# EAGLE design HS(LCD)_1 (EAGLE 8.3.0)
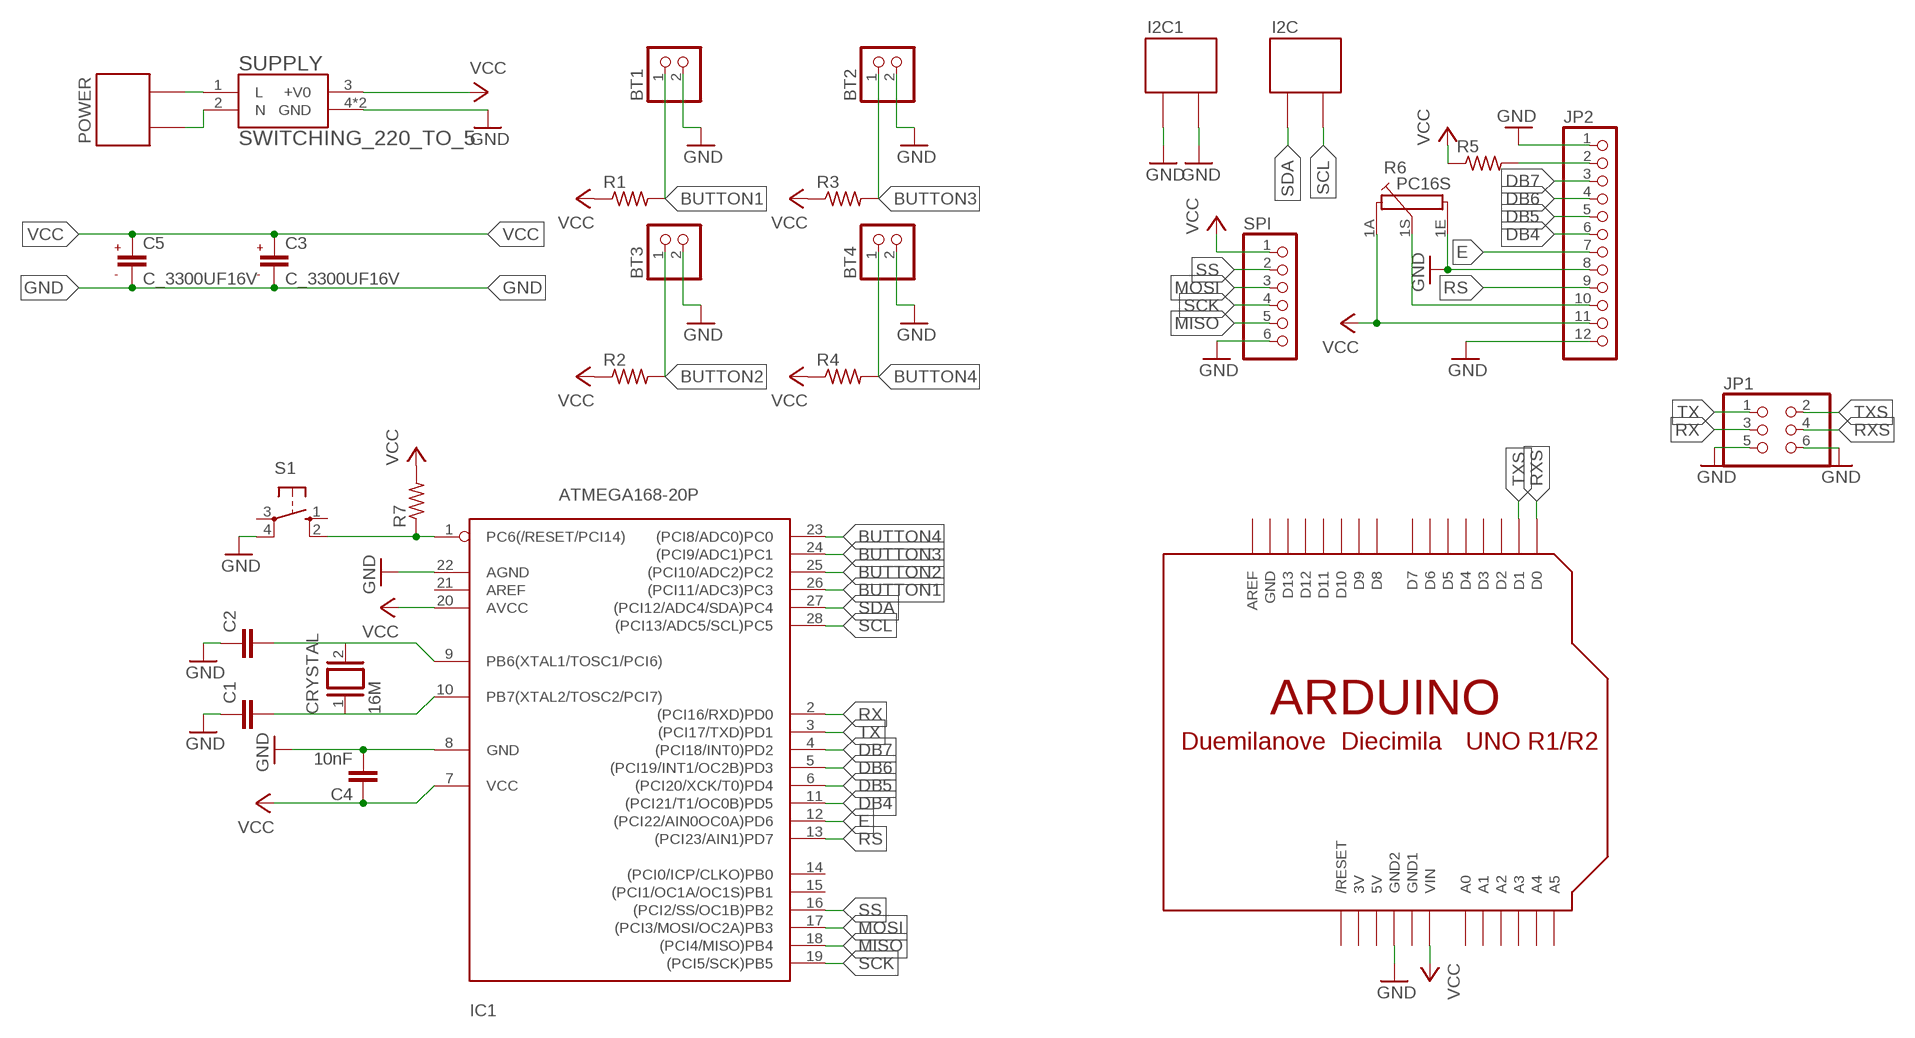
[diagram p0: schematic, sheet 1]

## Parts
BT1  PINHD-1X2  [1X02]
BT2  PINHD-1X2  [1X02]
BT3  PINHD-1X2  [1X02]
BT4  PINHD-1X2  [1X02]
C1  C-EU025-024X044  [C025-024X044]
C2  C-EU025-024X044  [C025-024X044]
C3  C_3300UF16V  [RADIAL_3300UF16V]
C4  10nF  C5/2.5  [C5B2.5]
C5  C_3300UF16V  [RADIAL_3300UF16V]
CRYSTAL  16M  XTAL/S  [QS]
I2C  2PIN_TERMINAL_BLOCK  [2PIN_TERMINAL_BLOCK]
I2C1  2PIN_TERMINAL_BLOCK  [2PIN_TERMINAL_BLOCK]
IC1  ATMEGA168-20P  [DIL28-3]
JP1  PINHD-2X3  [2X03]
JP2  PINHD-1X12  [1X12]
POWER  2PIN_TERMINAL_BLOCK  [2PIN_TERMINAL_BLOCK]
R1  R-US_0204/7  [0204/7]
R2  R-US_0204/7  [0204/7]
R3  R-US_0204/7  [0204/7]
R4  R-US_0204/7  [0204/7]
R5  R-US_0204/7  [0204/7]
R6  PC16S  [PC16S]
R7  R-US_0204/7  [0204/7]
S1  10-XX  [B3F-10XX]
SPI  PINHD-1X6  [1X06]
SUPPLY  SWITCHING_220_TO_5  [SUPPLY_220V_5V]
U$1  ARDUINO-NOHOLE  [ARDUINO-NOHOLE]

## Nets
BUTTON1: BT1.1 IC1.26((PCI11/ADC3)PC3) R1.2
BUTTON2: BT3.1 IC1.25((PCI10/ADC2)PC2) R2.2
BUTTON3: BT2.1 IC1.24((PCI9/ADC1)PC1) R3.2
BUTTON4: BT4.1 IC1.23((PCI8/ADC0)PC0) R4.2
DB4: IC1.11((PCI21/T1/OC0B)PD5) JP2.6
DB5: IC1.6((PCI20/XCK/T0)PD4) JP2.5
DB6: IC1.5((PCI19/INT1/OC2B)PD3) JP2.4
DB7: IC1.4((PCI18/INT0)PD2) JP2.3
E: IC1.12((PCI22/AIN0OC0A)PD6) JP2.7
GND: BT1.2 BT2.2 BT3.2 BT4.2 C1.1 C2.1 C3.1(GND) C4.2 C5.1(GND) I2C1.P$1 I2C1.P$2 IC1.8(GND) IC1.22(AGND) JP1.5 JP1.6 JP2.1 JP2.8 JP2.12 R6.1E S1.4(P1) SPI.6 SUPPLY.4(GND) SUPPLY.5(GND) U$1.GND2
LEDP: JP2.2 R5.2
MISO: IC1.18((PCI4/MISO)PB4) SPI.5
MOSI: IC1.17((PCI3/MOSI/OC2A)PB3) SPI.3
N$1: C2.2 CRYSTAL.2 IC1.9(PB6(XTAL1/TOSC1/PCI6))
N$2: C1.2 CRYSTAL.1 IC1.10(PB7(XTAL2/TOSC2/PCI7))
N$3: POWER.P$2 SUPPLY.1(L)
N$4: POWER.P$1 SUPPLY.2(N)
N$5: IC1.1(PC6(/RESET/PCI14)) R7.1 S1.2(S1)
RS: IC1.13((PCI23/AIN1)PD7) JP2.9
RX: IC1.2((PCI16/RXD)PD0) JP1.3
RXS: JP1.4 U$1.D0
SCK: IC1.19((PCI5/SCK)PB5) SPI.4
SCL: I2C.P$2 IC1.28((PCI13/ADC5/SCL)PC5)
SDA: I2C.P$1 IC1.27((PCI12/ADC4/SDA)PC4)
SS: IC1.16((PCI2/SS/OC1B)PB2) SPI.2
TX: IC1.3((PCI17/TXD)PD1) JP1.1
TXS: JP1.2 U$1.D1
V0: JP2.10 R6.1S
VCC: C3.2(VCC) C4.1 C5.2(VCC) IC1.7(VCC) IC1.20(AVCC) JP2.11 R1.1 R2.1 R3.1 R4.1 R5.1 R6.1A R7.2 SPI.1 SUPPLY.3(+V0) U$1.VIN
Unconnected: IC1.14((PCI0/ICP/CLKO)PB0) IC1.15((PCI1/OC1A/OC1S)PB1) IC1.21(AREF) S1.1(S) S1.3(P) U$1.A0 U$1.A1 U$1.A2 U$1.A3 U$1.A4 U$1.A5 U$1.AREF U$1.D2 U$1.D3 U$1.D4 U$1.D5 U$1.D6 U$1.D7 U$1.D8 U$1.D9 U$1.D10 U$1.D11 U$1.D12 U$1.D13 U$1.RESET(/RESET)

## Power pins joined to a net without a drawn wire
3V: U$1.3V
5V: U$1.5V
GND: U$1.GND
GND1: U$1.GND1

## Library data of the parts
BT1-BT4 = pinhead:PINHD-1X2: PIN HEADER
C1 C2 = resistor:C-EU: CAPACITOR, European symbol
C3 C5 = tu_capacitor:C_3300UF16V
C4 = capacitor-wima:C: CAPACITOR naming: grid - package width
CRYSTAL = special:XTAL/S: CRYSTAL
I2C I2C1 POWER = 2pin_terminal_block:2PIN_TERMINAL_BLOCK
IC1 = adafruit:ATMEGA168*P: MICROCONTROLLER 16 kBytes FLASH 1 kBytes SRAM 512 Bytes EEPROM USART 8-channel 10 bit ADC
JP1 = pinhead:PINHD-2X3: PIN HEADER
JP2 = pinhead:PINHD-1X12: PIN HEADER
R1-R4 R7 = adafruit:R-US_: RESISTOR, American symbol
R5 = rcl:R-US_: RESISTOR, American symbol
R6 = piher:PC16S: POTENTIOMETER single carbon potentiometer, 16 mm, S3ROH; OC_FARNELL: 4452940; OC_NEWARK: unknown
S1 = switch-omron:10-XX: OMRON SWITCH; MPN: B3F-1000; OC_FARNELL: 176432; OC_NEWARK: 36M3542
SPI = pinhead:PINHD-1X6: PIN HEADER
SUPPLY = switching_supply:SWITCHING_220_TO_5
U$1 = adafruit:ARDUINO: Arduino Diecimila/Duemilanove Make a shield with ease, this package has all the named pins as well as the two mounting drill holes and an outline of the USB and DC power connector. The outline is on the DIMENSION layer, so if your board house uses it they will cut the outline to match. http://www.ladyada.net/library/pcb/eaglelibrary.html

## Board
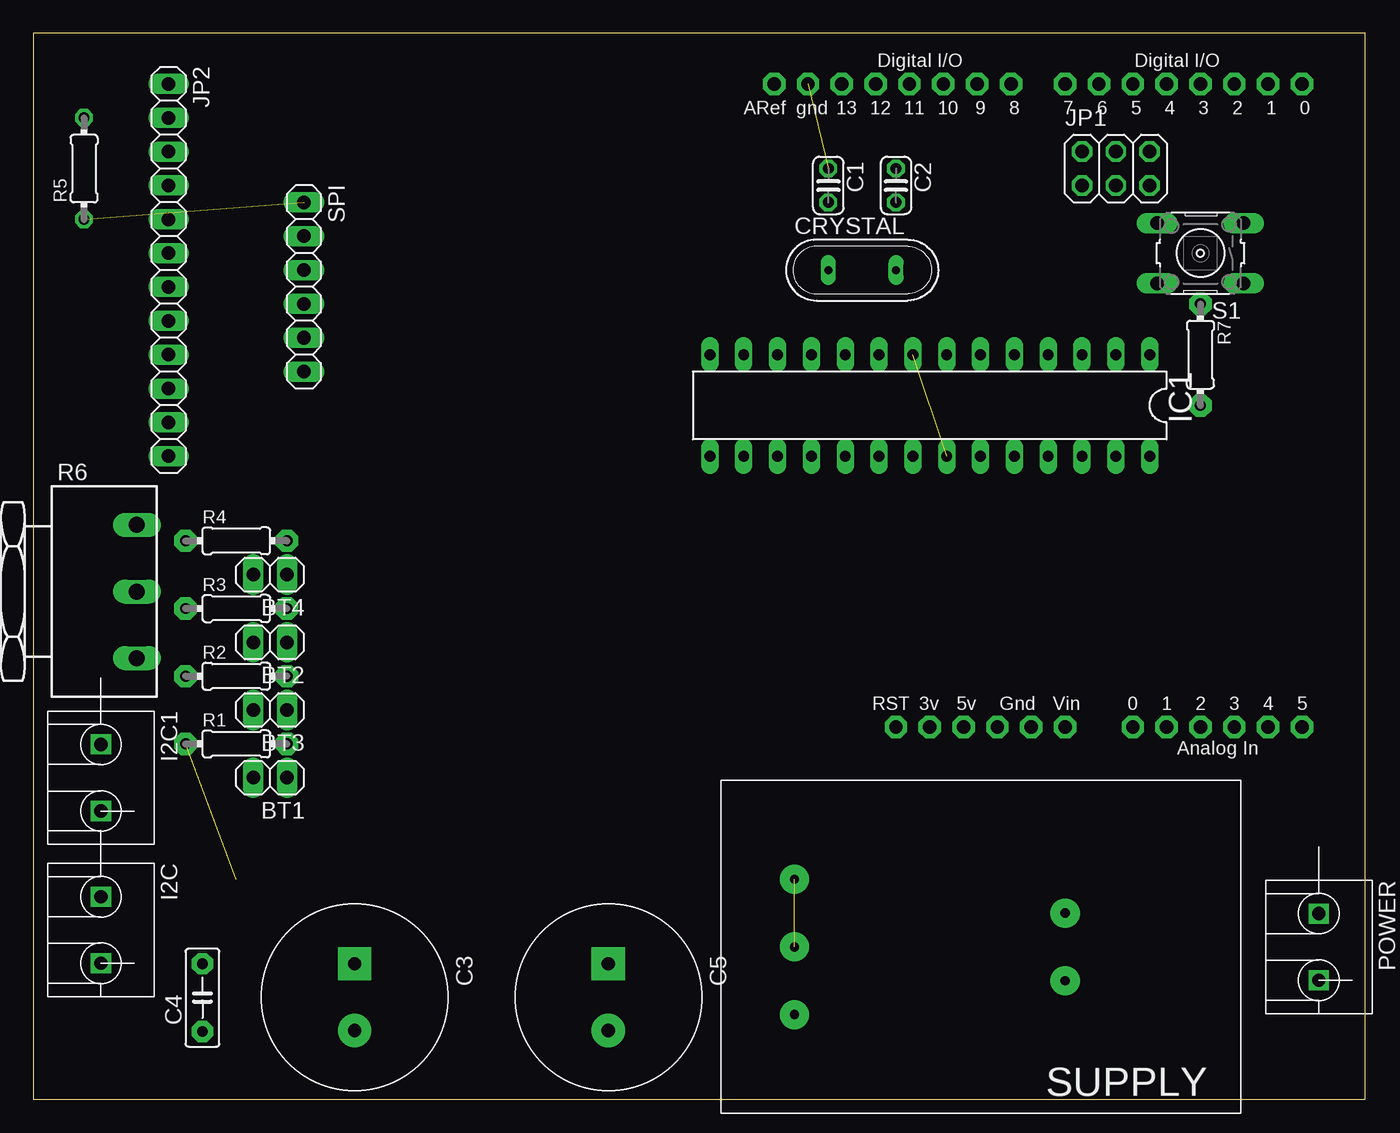
[diagram p1: board, top side]
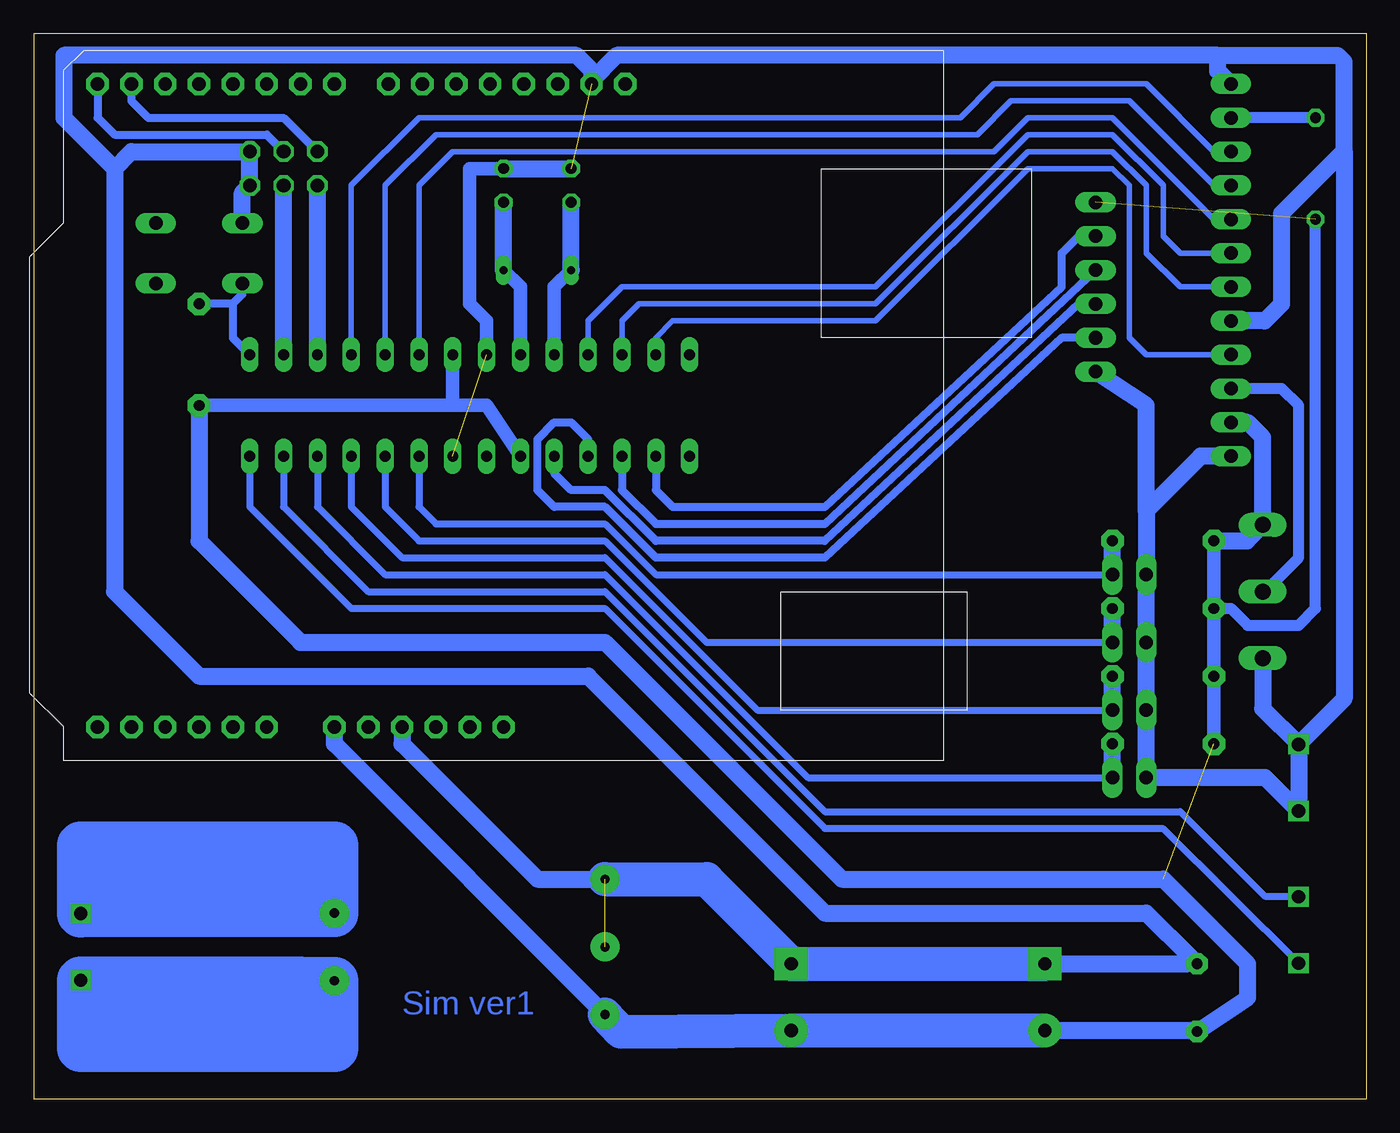
[diagram p2: board, bottom side, seen from below]

Size 100 x 80 mm. Coordinates in mm from the lower left corner, seen from the top.
Outline: 0,0 100,0 100,80 0,80 0,0
Copper layers (1*16): Top 0.035mm / dielectric 1.5mm / Bottom 0.035mm
Design rules "default": minimum track width 6mil, minimum drill 0.35mm, track to track 6mil, track to pad 6mil, pad to pad 6mil, via to via 6mil, smd to smd 6mil, copper to edge 40mil, drill to drill 6mil, minimum pad ring 10mil, minimum via ring 8mil, stop-mask expansion 4mil, vias tented up to drill 0mil, thermal gap 10mil

### Footprints (pad centres in the part's own frame; a part is rotated, then mirrored left to right if it is on the bottom)
1X02 = drill 1.016 long: 1 -1.27,0; 2 1.27,0
C025-024X044 = drill 0.813 octagon: 1 -1.27,0; 2 1.27,0
RADIAL_3300UF16V = drill 1 pad 2.5 square: 1 0,0 | drill 1 pad 2.5: 2 0,5
C5B2.5 = drill 0.813 pad 1.6 octagon: 1 -2.54,0; 2 2.54,0
QS = drill 0.61 long: 1 -2.54,0; 2 2.54,0
2PIN_TERMINAL_BLOCK = drill 1 square: P$1 -2.5,0; P$2 2.5,0
DIL28-3 = drill 0.813 long: 1 -16.51,-3.81; 2 -13.97,-3.81; 3 -11.43,-3.81; 4 -8.89,-3.81; 5 -6.35,-3.81; 6 -3.81,-3.81; 7 -1.27,-3.81; 8 1.27,-3.81; 9 3.81,-3.81; 10 6.35,-3.81; 11 8.89,-3.81; 12 11.43,-3.81; 13 13.97,-3.81; 14 16.51,-3.81; 15 16.51,3.81; 16 13.97,3.81; 17 11.43,3.81; 18 8.89,3.81; 19 6.35,3.81; 20 3.81,3.81; 21 1.27,3.81; 22 -1.27,3.81; 23 -3.81,3.81; 24 -6.35,3.81; 25 -8.89,3.81; 26 -11.43,3.81; 27 -13.97,3.81; 28 -16.51,3.81
2X03 = drill 1.016 octagon: 1 -2.54,-1.27; 2 -2.54,1.27; 3 0,-1.27; 4 0,1.27; 5 2.54,-1.27; 6 2.54,1.27
1X12 = drill 1.016 long: 1 -13.97,0; 2 -11.43,0; 3 -8.89,0; 4 -6.35,0; 5 -3.81,0; 6 -1.27,0; 7 1.27,0; 8 3.81,0; 9 6.35,0; 10 8.89,0; 11 11.43,0; 12 13.97,0
0204/7 = drill 0.813 pad 1.676 octagon: 1 -3.81,0; 2 3.81,0
0204/7' = drill 0.813 octagon: 1 -3.81,0; 2 3.81,0
PC16S = drill 1.2 long: 1A -5,6.5; 1E 5,6.5; 1S 0,6.5
B3F-10XX = drill 1.016 long: 1 -3.251,2.261; 2 3.251,2.261; 3 -3.251,-2.261; 4 3.251,-2.261
1X06 = drill 1.016 long: 1 -6.35,0; 2 -3.81,0; 3 -1.27,0; 4 1.27,0; 5 3.81,0; 6 6.35,0
SUPPLY_220V_5V = drill 0.7 pad 2.184: 1 -20.32,2.54; 2 -20.32,-2.54; 3 0,5.08; 4 0,0; 5 0,-5.08
ARDUINO-NOHOLE = drill 1 pad 1.676 octagon: 3V 35.56,2.54; 5V 38.1,2.54; A0 50.8,2.54; A1 53.34,2.54; A2 55.88,2.54; A3 58.42,2.54; A4 60.96,2.54; A5 63.5,2.54; AREF 23.876,50.8; D0 63.5,50.8; D1 60.96,50.8; D2 58.42,50.8; D3 55.88,50.8; D4 53.34,50.8; D5 50.8,50.8; D6 48.26,50.8; D7 45.72,50.8; D8 41.656,50.8; D9 39.116,50.8; D10 36.576,50.8; D11 34.036,50.8; D12 31.496,50.8; D13 28.956,50.8; GND 26.416,50.8; GND1 43.18,2.54; GND2 40.64,2.54; RESET 33.02,2.54; VIN 45.72,2.54

### Placement (x,y rotation side)
BT1  17.78,24.13 180 top
BT2  17.78,34.29 180 top
BT3  17.78,29.21 180 top
BT4  17.78,39.37 180 top
C1  59.69,68.58 270 top
C2  64.77,68.58 270 top
C3  24.13,10.16 180 top
C4  12.7,7.62 90 top
C5  43.18,10.16 180 top
CRYSTAL  62.23,62.23 0 top
I2C  5.08,12.7 270 top
I2C1  5.08,24.13 270 top
IC1  67.31,52.07 180 top
JP1  81.28,69.85 0 top
JP2  10.16,62.23 270 top
POWER  96.52,11.43 270 top
R1  15.24,26.67 0 top
R2  15.24,31.75 0 top
R3  15.24,36.83 0 top
R4  15.24,41.91 0 top
R5  [0204/7']  3.81,69.85 90 top
R6  1.27,38.1 270 top
R7  87.63,55.88 270 top
S1  87.63,63.5 180 top
SPI  20.32,60.96 270 top
SUPPLY  57.15,11.43 180 top
U$1  31.75,25.4 0 top

### Tracks (layer width: path | path; a pad name or v marks a point on that pad's centre or on a via)
BUTTON1
  Bottom 0.508: IC1.26 78.74,44.45 73.66,39.37 57.15,39.37 41.91,24.13 BT1.1
  Bottom 1.27: BT1.1 R1.2
BUTTON2
  Bottom 0.508: IC1.25 76.2,44.45 72.39,40.64 57.15,40.64 45.72,29.21 BT3.1
  Bottom 1.27: BT3.1 R2.2
BUTTON3
  Bottom 0.508: IC1.24 73.66,44.45 71.12,41.91 57.15,41.91 49.53,34.29 BT2.1
  Bottom 1.27: BT2.1 R3.2
BUTTON4
  Bottom 0.508: IC1.23 71.12,44.45 69.85,43.18 57.15,43.18 53.34,39.37 BT4.1
  Bottom 1.27: BT4.1 R4.2
DB4
  Bottom 0.406: JP2.6 13.97,63.5 15.24,64.77 15.24,68.58 19.05,72.39 25.4,72.39 36.83,60.96 55.88,60.96 58.42,58.42 IC1.11
DB5
  Bottom 0.406: JP2.5 11.43,66.04 19.05,73.66 25.4,73.66 27.94,71.12 68.58,71.12 71.12,68.58 IC1.6
DB6
  Bottom 0.406: IC1.5 73.66,68.58 69.85,72.39 29.21,72.39 26.67,74.93 17.78,74.93 11.43,68.58 JP2.4
DB7
  Bottom 0.406: JP2.3 11.43,71.12 16.51,76.2 27.94,76.2 30.48,73.66 71.12,73.66 76.2,68.58 IC1.4
E
  Bottom 0.406: IC1.12 55.88,58.42 54.61,59.69 36.83,59.69 25.4,71.12 19.05,71.12 16.51,68.58 16.51,63.5 13.97,60.96 JP2.7
GND  (3 unrouted)
  Bottom 1.016: IC1.8 66.04,58.42 67.31,59.69 67.31,69.85 C2.1
  Bottom 1.27: C2.1 C1.1 | 58.17,76.45 58.17,77.22 59.3,78.35 97.79,78.35 97.79,73.66 93.98,69.85 | 93.98,69.85 93.98,38.1 87.63,31.75 58.42,31.75 40.64,13.97 16.51,13.97 13.1,10.56 | 13.1,10.56 C4.2 | I2C1.P$1 I2C1.P$2 7.58,24.13 BT1.2 BT3.2 BT2.2 BT4.2 16.51,44.18 | U$1.GND2 72.39,26.67 62.23,16.51 SUPPLY.5 | C3.1 13.5,10.16 13.1,10.56 | U$1.GND 58.17,76.45 | 58.17,76.45 56.27,78.35 11.14,78.35 | 1.65,71.18 1.65,77.85 2.15,78.35 11.14,78.35 | 1.65,71.18 1.65,30.06 I2C1.P$1 | R6.1E 7.77,29.32 I2C1.P$1 | JP2.8 7.62,58.42 6.35,59.69 6.35,66.48 1.65,71.18 | 16.51,44.18 16.51,52.07 SPI.6 | JP2.12 12.43,48.26 16.51,44.18 | 93.98,69.85 92.71,71.12 JP1.6 JP1.5 84.38,68.02 S1.4 | JP2.1 11.14,77.18 11.14,78.35
  Bottom 2.54: SUPPLY.5 49.53,16.51 C5.1 C3.1
LEDP
  Bottom 0.813: R5.2 JP2.2
MISO
  Bottom 0.61: SPI.5 22.86,57.15 40.64,40.64 53.34,40.64 57.15,44.45 60.96,44.45 62.23,45.72 62.23,49.53 60.96,50.8 59.69,50.8 58.42,49.53 IC1.18
MOSI
  Bottom 0.61: IC1.17 55.88,45.72 53.34,43.18 40.64,43.18 SPI.3
N$1
  Bottom 1.016: IC1.9 63.5,60.96 CRYSTAL.2
  Bottom 1.27: CRYSTAL.2 C2.2
N$2
  Bottom 1.016: IC1.10 60.96,60.96 CRYSTAL.1
  Bottom 1.27: CRYSTAL.1 C1.2
N$3
  Bottom 3.556: 77.47,6.35 96.52,6.35 | 96.52,6.35 POWER.P$2 80.05,8.93 SUPPLY.1 77.47,6.35 | 96.52,6.35 96.52,3.81 77.47,3.81 77.47,6.35
N$4
  Bottom 3.556: 96.52,13.97 SUPPLY.2 77.47,16.51 | 77.47,16.51 96.52,16.51 | 96.52,16.51 96.52,19.05 77.47,19.05 77.47,16.51 | 96.52,16.51 96.52,13.97 | 96.52,13.97 POWER.P$1
N$5
  Bottom 0.61: S1.2 84.38,60.4 85.09,59.69 | 85.09,59.69 R7.1 | 85.09,59.69 85.09,57.15 IC1.1
RS
  Bottom 0.406: IC1.13 53.34,57.15 52.07,58.42 36.83,58.42 25.4,69.85 19.05,69.85 17.78,68.58 17.78,57.15 16.51,55.88 JP2.9
RX
  Bottom 1.27: IC1.2 JP1.3
RXS
  Bottom 0.61: U$1.D0 95.25,73.66 93.98,72.39 82.55,72.39 JP1.4
SCK
  Bottom 0.61: SPI.4 21.59,59.69 40.64,41.91 53.34,41.91 57.15,45.72 59.69,45.72 60.96,46.99 IC1.19
SCL
  Bottom 0.508: IC1.28 83.82,44.45 76.2,36.83 57.15,36.83 40.64,20.32 15.28,20.32 I2C.P$2
SDA
  Bottom 0.508: IC1.27 81.28,44.45 74.93,38.1 57.15,38.1 40.64,21.59 13.97,21.59 7.62,15.24 5.12,15.24 I2C.P$1
SS
  Bottom 0.61: IC1.16 53.34,45.72 52.07,44.45 40.64,44.45 22.86,60.96 22.86,63.5 21.59,64.77 SPI.2
TX
  Bottom 1.27: IC1.3 JP1.1
TXS
  Bottom 0.61: U$1.D1 92.71,74.93 91.44,73.66 81.28,73.66 JP1.2
V0
  Bottom 0.813: R6.1S 7.62,38.1 5.08,40.64 5.08,52.07 6.35,53.34 JP2.10
VCC  (2 unrouted)
  Bottom 0.813: R3.1 10.16,36.83 8.89,35.56 5.08,35.56 3.81,36.83 R5.1
  Bottom 1.016: R7.2 68.58,52.07 | IC1.20 66.04,52.07 68.58,52.07 | 68.58,52.07 IC1.7 | R1.1 R2.1 R3.1 R4.1
  Bottom 1.27: R7.2 87.63,41.91 80.01,34.29 57.15,34.29 39.37,16.51 15.24,16.51 8.89,10.16 8.89,7.62 C4.1 12.78,5.16 C3.2 | SUPPLY.3 77.47,26.67 U$1.VIN | R4.1 8.96,41.91 R6.1A 7.77,49.68 8.89,50.8 JP2.11
  Bottom 2.54: SUPPLY.3 55.96,5.08 C5.2 C3.2

### Text on the board
Bottom: Sim ver1